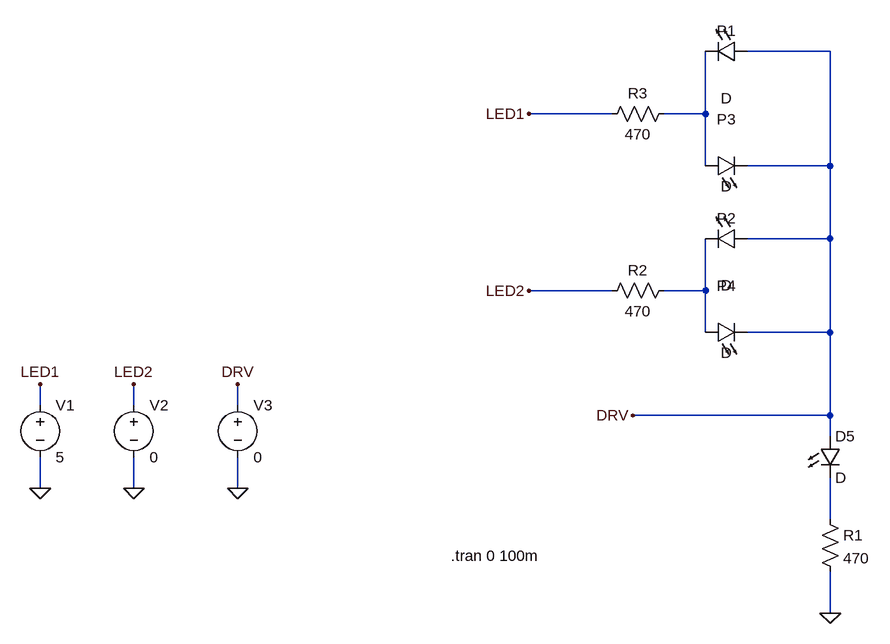
[diagram p0: schematic Draft1.asc]
Draft1.asc, the LTspice schematic file:
Version 4.1
SHEET 1 880 1060
WIRE 384 176 256 176
WIRE 48 272 -80 272
WIRE 192 272 192 176
WIRE 192 272 128 272
WIRE 192 352 192 272
WIRE 384 352 384 176
WIRE 384 352 256 352
WIRE 384 464 384 352
WIRE 384 464 256 464
WIRE 48 544 -80 544
WIRE 192 544 192 464
WIRE 192 544 128 544
WIRE 192 608 192 544
WIRE 384 608 384 464
WIRE 384 608 256 608
WIRE -832 720 -832 688
WIRE -688 720 -688 688
WIRE -528 720 -528 688
WIRE 384 736 384 608
WIRE 384 736 80 736
WIRE 384 768 384 736
WIRE -832 848 -832 800
WIRE -688 848 -688 800
WIRE -528 848 -528 800
WIRE 384 896 384 832
WIRE 384 1040 384 976
FLAG 384 1040 0
FLAG -832 848 0
FLAG -688 848 0
FLAG -528 848 0
FLAG -528 688 DRV
FLAG -688 688 LED2
FLAG -832 688 LED1
FLAG 80 736 DRV
FLAG -80 272 LED1
FLAG -80 544 LED2
SYMBOL LED 256 160 R90
WINDOW 0 0 32 VBottom 2
WINDOW 3 72 32 VTop 2
SYMATTR InstName P1
SYMBOL LED 192 368 R270
WINDOW 0 72 32 VTop 2
WINDOW 3 0 32 VBottom 2
SYMATTR InstName P3
SYMBOL LED 192 624 R270
WINDOW 0 72 32 VTop 2
WINDOW 3 0 32 VBottom 2
SYMATTR InstName P4
SYMBOL LED 256 448 R90
WINDOW 0 0 32 VBottom 2
WINDOW 3 72 32 VTop 2
SYMATTR InstName P2
SYMBOL LED 368 768 R0
SYMATTR InstName D5
SYMBOL res 368 880 R0
SYMATTR InstName R1
SYMATTR Value 470
SYMBOL res 144 528 R90
WINDOW 0 0 56 VBottom 2
WINDOW 3 32 56 VTop 2
SYMATTR InstName R2
SYMATTR Value 470
SYMBOL res 144 256 R90
WINDOW 0 0 56 VBottom 2
WINDOW 3 32 56 VTop 2
SYMATTR InstName R3
SYMATTR Value 470
SYMBOL voltage -832 704 R0
WINDOW 123 0 0 Left 0
WINDOW 39 0 0 Left 0
SYMATTR InstName V1
SYMATTR Value 5
SYMBOL voltage -688 704 R0
WINDOW 123 0 0 Left 0
WINDOW 39 0 0 Left 0
SYMATTR InstName V2
SYMATTR Value 0
SYMBOL voltage -528 704 R0
WINDOW 123 0 0 Left 0
WINDOW 39 0 0 Left 0
SYMATTR InstName V3
SYMATTR Value 0
TEXT -200 952 Left 2 !.tran 0 100m

The netlist it stands for:
* Draft1.asc
D§P1 DRV N001 D
D§P3 N001 DRV D
D§P4 N002 DRV D
D§P2 DRV N002 D
D5 DRV N003 D
R1 N003 0 470
R2 N002 LED2 470
R3 N001 LED1 470
V1 LED1 0 5
V2 LED2 0 0
V3 DRV 0 0
.model D D
.lib standard.dio
.tran 0 100m
.backanno
.end